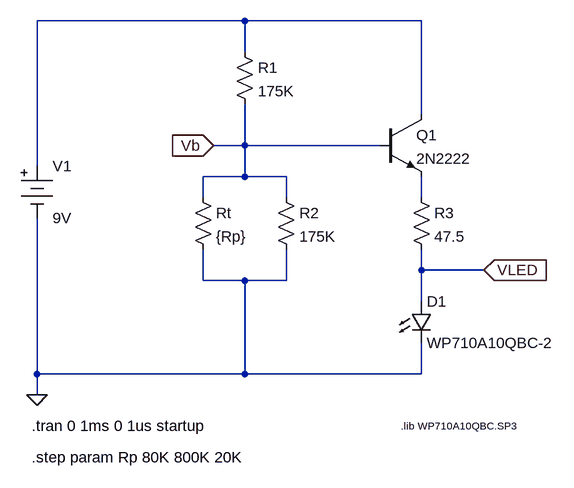
[diagram p0: schematic Draft1.asc]
Draft1.asc, the LTspice schematic file:
Version 4
SHEET 1 908 736
WIRE 432 48 112 48
WIRE 704 48 432 48
WIRE 432 96 432 48
WIRE 704 192 704 48
WIRE 432 240 432 176
WIRE 432 240 384 240
WIRE 640 240 432 240
WIRE 112 272 112 48
WIRE 432 288 432 240
WIRE 432 288 368 288
WIRE 496 288 432 288
WIRE 368 320 368 288
WIRE 496 320 496 288
WIRE 704 320 704 288
WIRE 704 432 704 400
WIRE 800 432 704 432
WIRE 368 448 368 400
WIRE 432 448 368 448
WIRE 496 448 496 400
WIRE 496 448 432 448
WIRE 704 480 704 432
WIRE 112 592 112 352
WIRE 432 592 432 448
WIRE 432 592 112 592
WIRE 704 592 704 544
WIRE 704 592 432 592
WIRE 112 624 112 592
FLAG 384 240 Vb
IOPIN 384 240 In
FLAG 800 432 VLED
IOPIN 800 432 In
FLAG 112 624 0
SYMBOL Misc/battery 112 256 R0
SYMATTR InstName V1
SYMATTR Value 9V
SYMBOL res 416 80 R0
SYMATTR InstName R1
SYMATTR Value 175K
SYMBOL npn 640 192 R0
SYMATTR InstName Q1
SYMATTR Value 2N2222
SYMBOL res 480 304 R0
SYMATTR InstName R2
SYMATTR Value 175K
SYMBOL res 352 304 R0
SYMATTR InstName Rt
SYMATTR Value {Rp}
SYMBOL res 688 304 R0
SYMATTR InstName R3
SYMATTR Value 47.5
SYMBOL LED 688 480 R0
SYMATTR InstName D1
SYMATTR Value WP710A10QBC-2
TEXT 672 672 Left 1 !.lib WP710A10QBC.SP3
TEXT 104 672 Left 2 !.tran 0 1ms 0 1us startup
TEXT 104 720 Left 2 !.step param Rp 80K 800K 20K

The netlist it stands for:
* Draft1.asc
V1 N001 0 9V
R1 N001 Vb 175K
Q1 N001 Vb N002 0 2N2222
R2 Vb 0 175K
Rt Vb 0 {Rp}
R3 N002 VLED 47.5
D1 VLED 0 WP710A10QBC-2
.model D D
.lib standard.dio
.model NPN NPN
.model PNP PNP
.lib standard.bjt
.lib WP710A10QBC.SP3
.tran 0 1ms 0 1us startup
.step param Rp 80K 800K 20K
.backanno
.end